# EAGLE schematic trig3_board_trigger_waveshare_lvds (EAGLE 9.6.2)
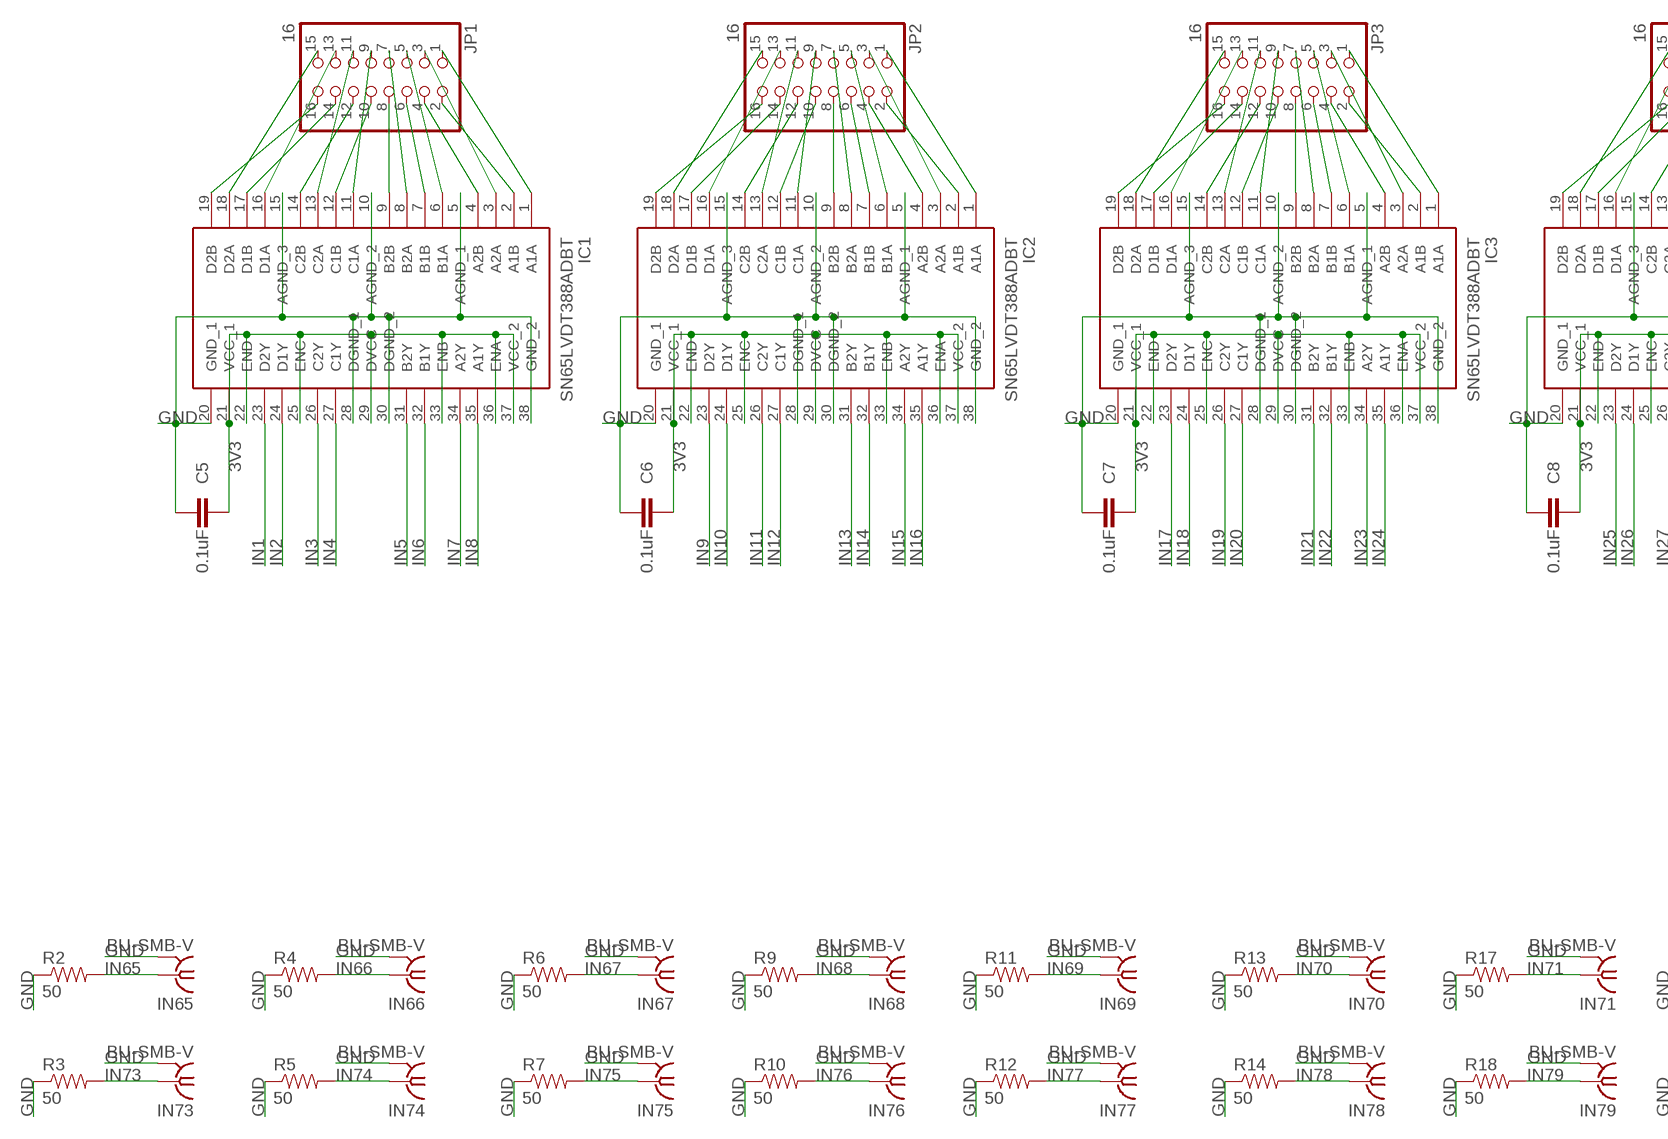
[diagram p0: schematic, sheet 1, part 1 of 3]
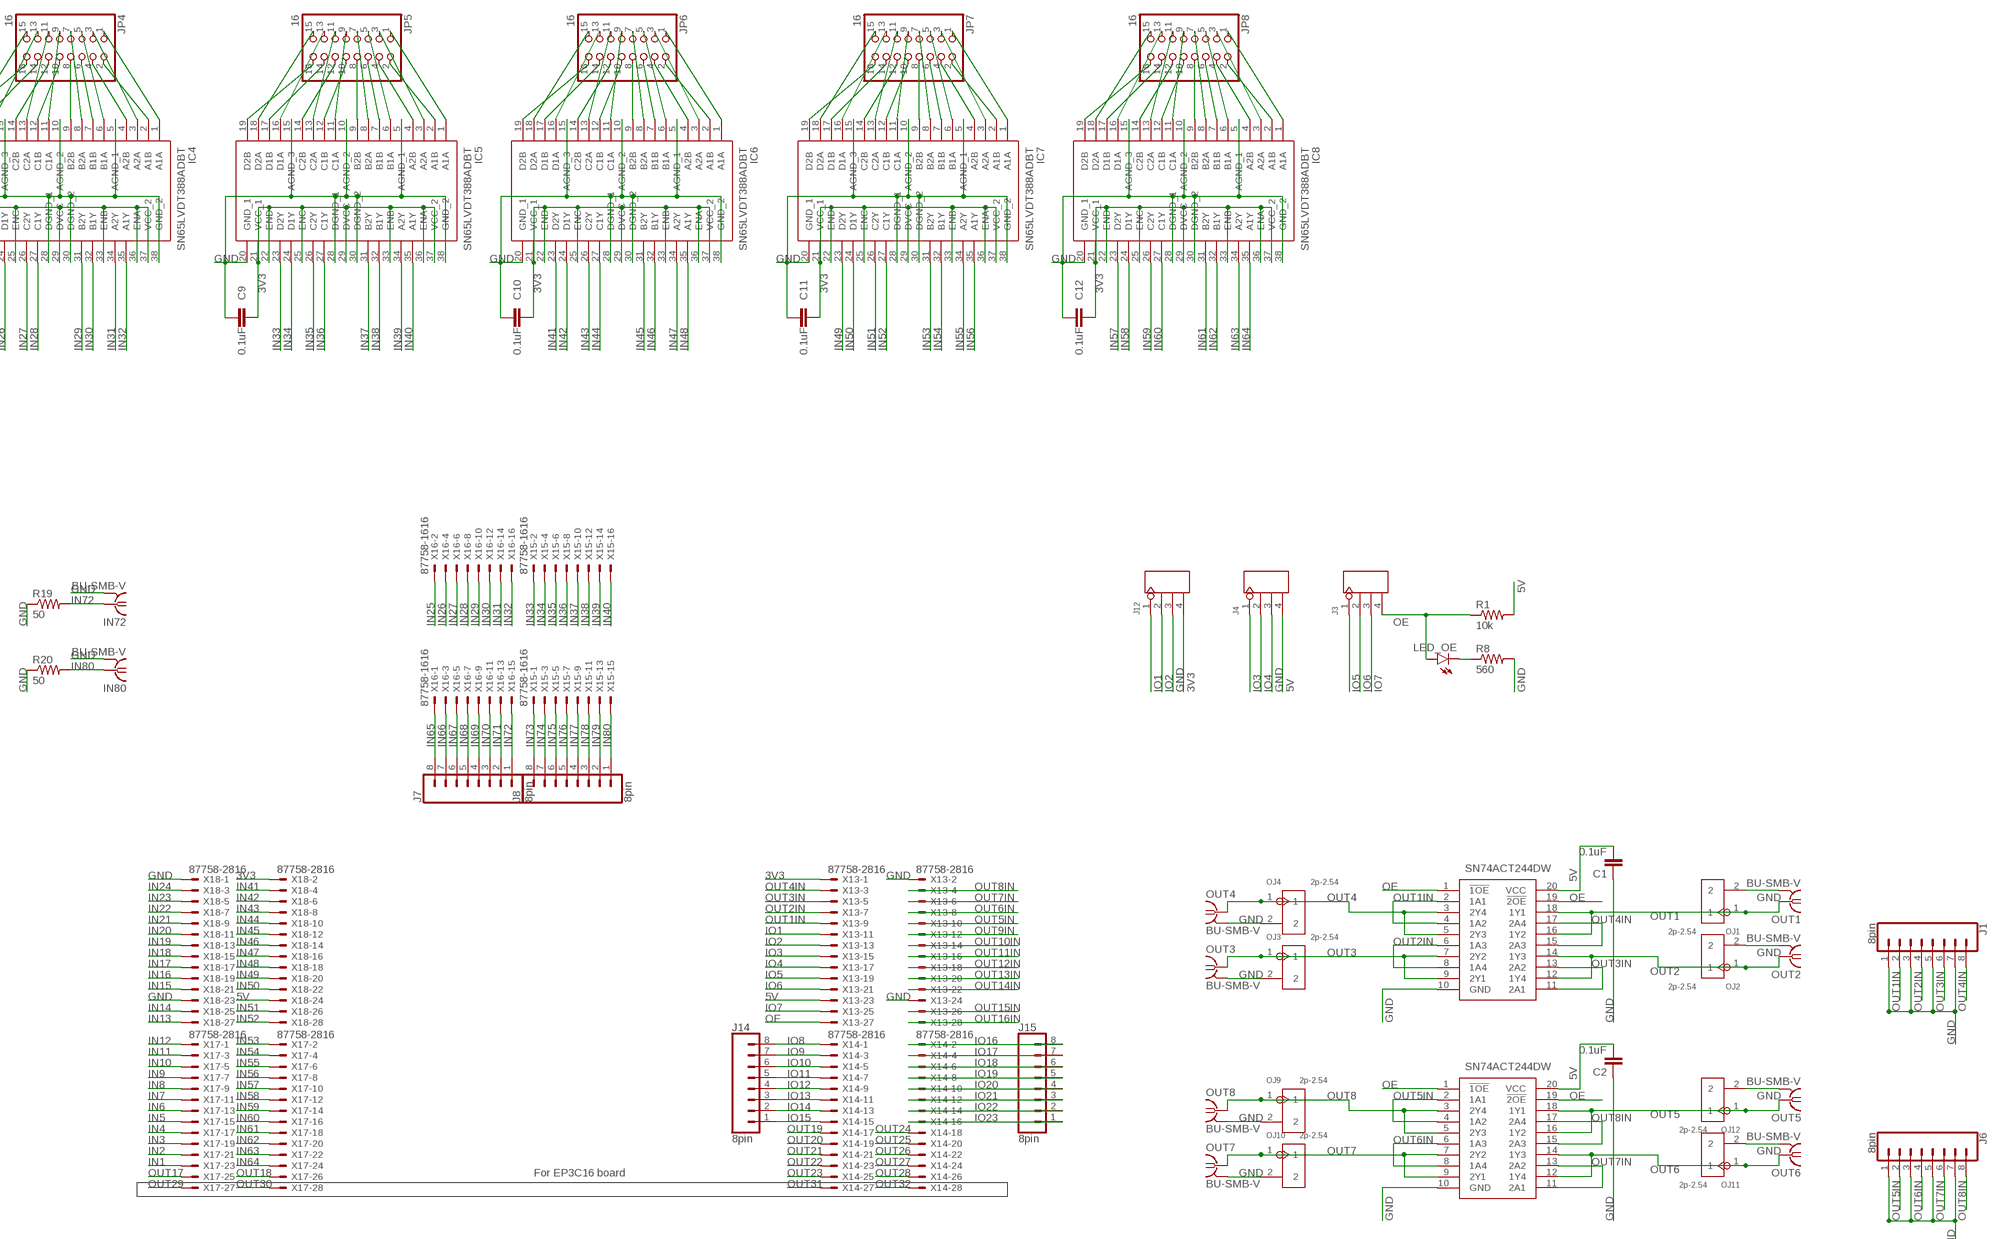
[diagram p1: schematic, sheet 1, part 2 of 3]
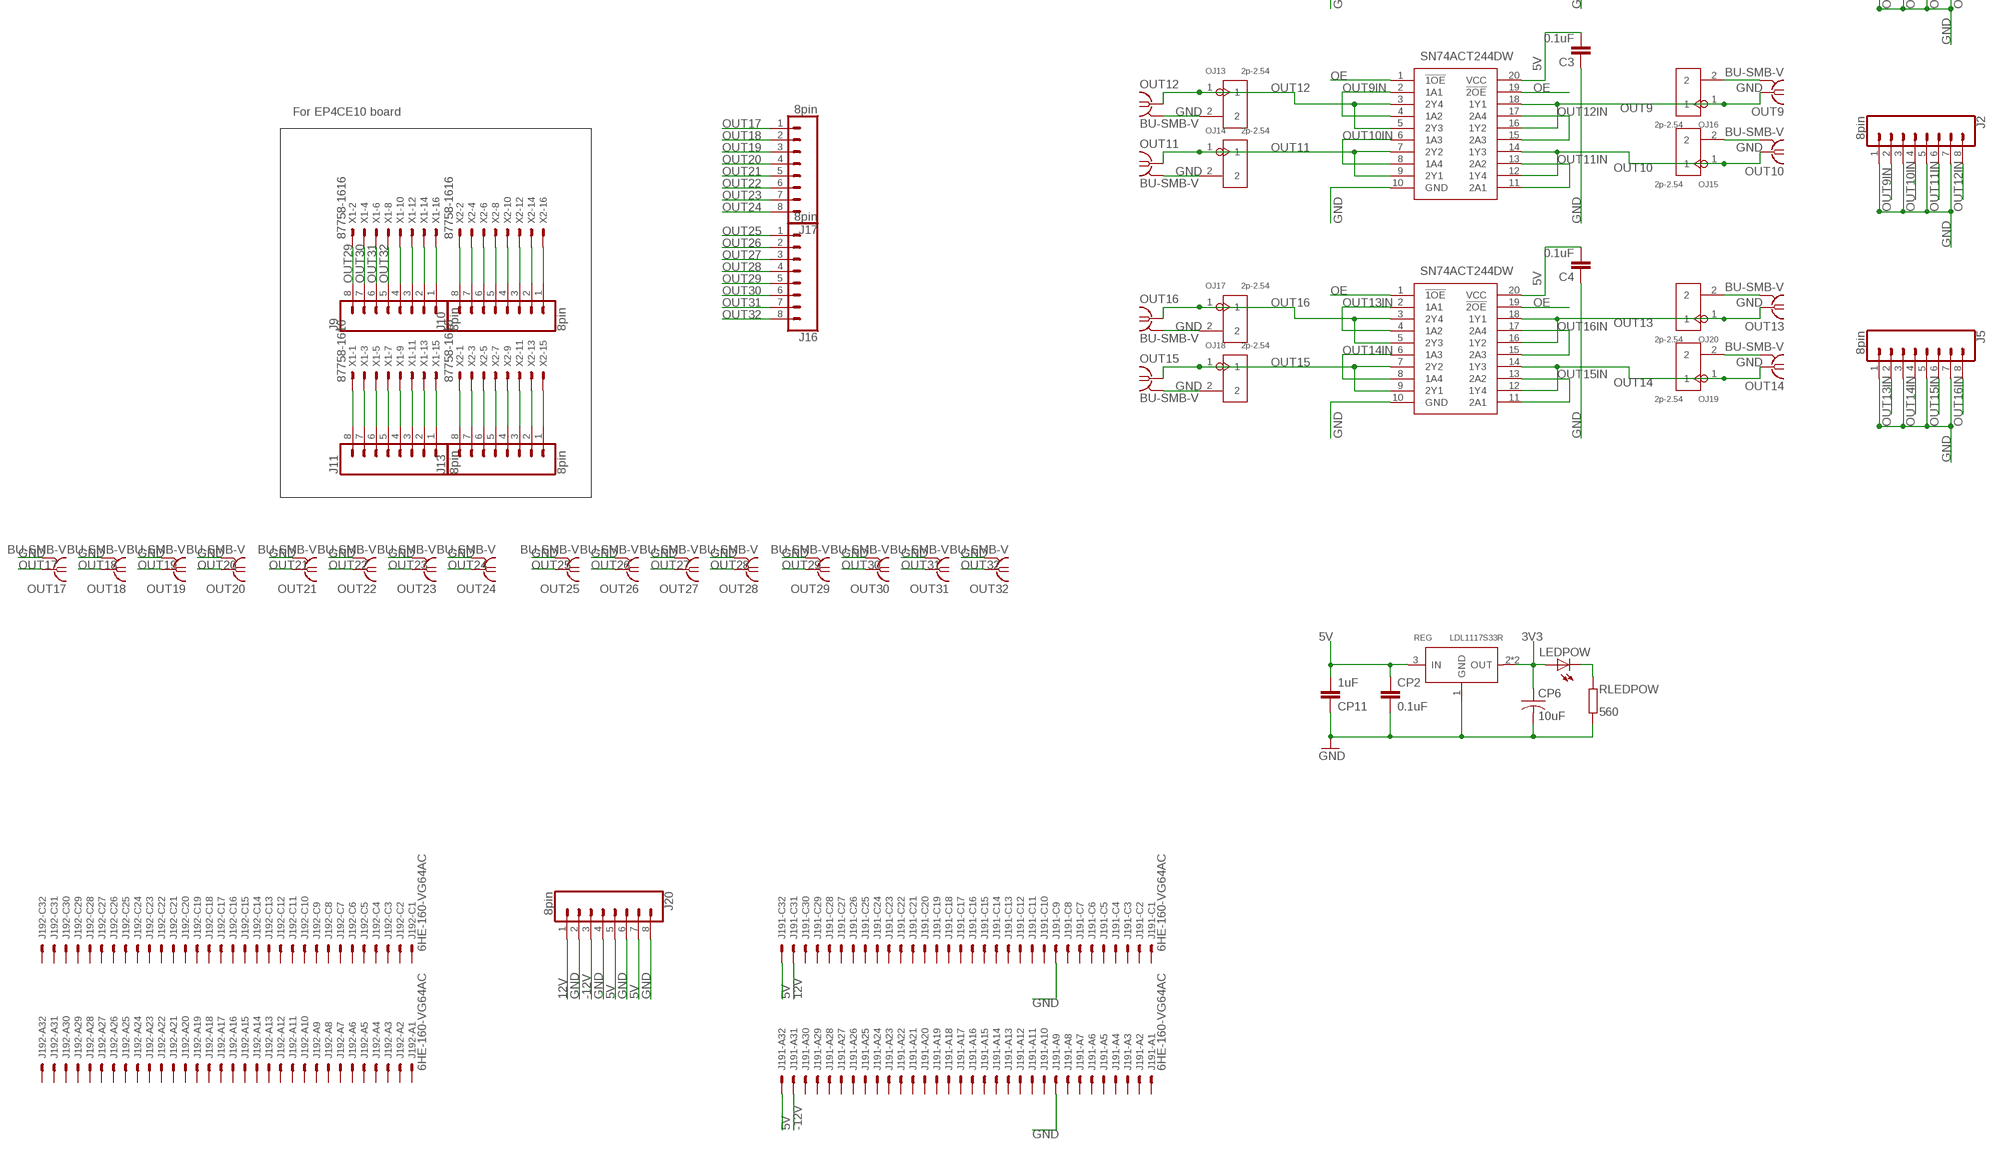
[diagram p2: schematic, sheet 1, part 3 of 3]

## Parts
C1  0.1uF  CAP0805  [0805]
C2  0.1uF  CAP0805  [0805]
C3  0.1uF  CAP0805  [0805]
C4  0.1uF  CAP0805  [0805]
C5  0.1uF  CAP0805  [0805]
C6  0.1uF  CAP0805  [0805]
C7  0.1uF  CAP0805  [0805]
C8  0.1uF  CAP0805  [0805]
C9  0.1uF  CAP0805  [0805]
C10  0.1uF  CAP0805  [0805]
C11  0.1uF  CAP0805  [0805]
C12  0.1uF  CAP0805  [0805]
CP2  0.1uF  C-EUC0805K  [C0805K]
CP6  10uF  C-USC1206  [C1206]
CP11  1uF  C-EUC0805K  [C0805K]
IC1  SN65LVDT388ADBT  [SOP50P640X120-38N]
IC2  SN65LVDT388ADBT  [SOP50P640X120-38N]
IC3  SN65LVDT388ADBT  [SOP50P640X120-38N]
IC4  SN65LVDT388ADBT  [SOP50P640X120-38N]
IC5  SN65LVDT388ADBT  [SOP50P640X120-38N]
IC6  SN65LVDT388ADBT  [SOP50P640X120-38N]
IC7  SN65LVDT388ADBT  [SOP50P640X120-38N]
IC8  SN65LVDT388ADBT  [SOP50P640X120-38N]
IN65  BU-SMB-V  [BU-SMB-V]
IN66  BU-SMB-V  [BU-SMB-V]
IN67  BU-SMB-V  [BU-SMB-V]
IN68  BU-SMB-V  [BU-SMB-V]
IN69  BU-SMB-V  [BU-SMB-V]
IN70  BU-SMB-V  [BU-SMB-V]
IN71  BU-SMB-V  [BU-SMB-V]
IN72  BU-SMB-V  [BU-SMB-V]
IN73  BU-SMB-V  [BU-SMB-V]
IN74  BU-SMB-V  [BU-SMB-V]
IN75  BU-SMB-V  [BU-SMB-V]
IN76  BU-SMB-V  [BU-SMB-V]
IN77  BU-SMB-V  [BU-SMB-V]
IN78  BU-SMB-V  [BU-SMB-V]
IN79  BU-SMB-V  [BU-SMB-V]
IN80  BU-SMB-V  [BU-SMB-V]
J1  8pin  CONN_08"  [1X08]
J2  8pin  CONN_08"  [1X08]
J3  4p-2.54  DIP-BLACK-FEMALE-HEADER-VERT(4P-2.54)  [H4-2.54]
J4  4p-2.54  DIP-BLACK-FEMALE-HEADER-VERT(4P-2.54)  [H4-2.54]
J5  8pin  CONN_08"  [1X08]
J6  8pin  CONN_08"  [1X08]
J7  8pin  CONN_08"  [1X08]
J8  8pin  CONN_08"  [1X08]
J9  8pin  CONN_08"  [1X08]
J10  8pin  CONN_08"  [1X08]
J11  8pin  CONN_08"  [1X08]
J12  4p-2.54  DIP-BLACK-FEMALE-HEADER-VERT(4P-2.54)  [H4-2.54]
J13  8pin  CONN_08"  [1X08]
J14  8pin  CONN_08"  [1X08]
J15  8pin  CONN_08"  [1X08]
J16  8pin  CONN_08"  [1X08]
J17  8pin  CONN_08"  [1X08]
J19  6HE-160-VG64AC  [6HE_160-VG64AC]
J20  8pin  CONN_08"  [1X08]
JP1  16  PINHD-2X8/90  [2X08/90]
JP2  16  PINHD-2X8/90  [2X08/90]
JP3  16  PINHD-2X8/90  [2X08/90]
JP4  16  PINHD-2X8/90  [2X08/90]
JP5  16  PINHD-2X8/90  [2X08/90]
JP6  16  PINHD-2X8/90  [2X08/90]
JP7  16  PINHD-2X8/90  [2X08/90]
JP8  16  PINHD-2X8/90  [2X08/90]
LED_OE  OutputEn  LEDCHIP-LED0805  [CHIP-LED0805]
LEDPOW  MF-LED-0805-RED  LEDSML0805  [SML0805]
OJ1  2p-2.54  DIP-BLACK-MALE-HEADER-VERT(2P-2.54)  [H2-2.54]
OJ2  2p-2.54  DIP-BLACK-MALE-HEADER-VERT(2P-2.54)  [H2-2.54]
OJ3  2p-2.54  DIP-BLACK-MALE-HEADER-VERT(2P-2.54)  [H2-2.54]
OJ4  2p-2.54  DIP-BLACK-MALE-HEADER-VERT(2P-2.54)  [H2-2.54]
OJ9  2p-2.54  DIP-BLACK-MALE-HEADER-VERT(2P-2.54)  [H2-2.54]
OJ10  2p-2.54  DIP-BLACK-MALE-HEADER-VERT(2P-2.54)  [H2-2.54]
OJ11  2p-2.54  DIP-BLACK-MALE-HEADER-VERT(2P-2.54)  [H2-2.54]
OJ12  2p-2.54  DIP-BLACK-MALE-HEADER-VERT(2P-2.54)  [H2-2.54]
OJ13  2p-2.54  DIP-BLACK-MALE-HEADER-VERT(2P-2.54)  [H2-2.54]
OJ14  2p-2.54  DIP-BLACK-MALE-HEADER-VERT(2P-2.54)  [H2-2.54]
OJ15  2p-2.54  DIP-BLACK-MALE-HEADER-VERT(2P-2.54)  [H2-2.54]
OJ16  2p-2.54  DIP-BLACK-MALE-HEADER-VERT(2P-2.54)  [H2-2.54]
OJ17  2p-2.54  DIP-BLACK-MALE-HEADER-VERT(2P-2.54)  [H2-2.54]
OJ18  2p-2.54  DIP-BLACK-MALE-HEADER-VERT(2P-2.54)  [H2-2.54]
OJ19  2p-2.54  DIP-BLACK-MALE-HEADER-VERT(2P-2.54)  [H2-2.54]
OJ20  2p-2.54  DIP-BLACK-MALE-HEADER-VERT(2P-2.54)  [H2-2.54]
OUT1  BU-SMB-V  [BU-SMB-V]
OUT2  BU-SMB-V  [BU-SMB-V]
OUT3  BU-SMB-V  [BU-SMB-V]
OUT4  BU-SMB-V  [BU-SMB-V]
OUT5  BU-SMB-V  [BU-SMB-V]
OUT6  BU-SMB-V  [BU-SMB-V]
OUT7  BU-SMB-V  [BU-SMB-V]
OUT8  BU-SMB-V  [BU-SMB-V]
OUT9  BU-SMB-V  [BU-SMB-V]
OUT10  BU-SMB-V  [BU-SMB-V]
OUT11  BU-SMB-V  [BU-SMB-V]
OUT12  BU-SMB-V  [BU-SMB-V]
OUT13  BU-SMB-V  [BU-SMB-V]
OUT14  BU-SMB-V  [BU-SMB-V]
OUT15  BU-SMB-V  [BU-SMB-V]
OUT16  BU-SMB-V  [BU-SMB-V]
OUT17  BU-SMB-V  [BU-SMB-V]
OUT18  BU-SMB-V  [BU-SMB-V]
OUT19  BU-SMB-V  [BU-SMB-V]
OUT20  BU-SMB-V  [BU-SMB-V]
OUT21  BU-SMB-V  [BU-SMB-V]
OUT22  BU-SMB-V  [BU-SMB-V]
OUT23  BU-SMB-V  [BU-SMB-V]
OUT24  BU-SMB-V  [BU-SMB-V]
OUT25  BU-SMB-V  [BU-SMB-V]
OUT26  BU-SMB-V  [BU-SMB-V]
OUT27  BU-SMB-V  [BU-SMB-V]
OUT28  BU-SMB-V  [BU-SMB-V]
OUT29  BU-SMB-V  [BU-SMB-V]
OUT30  BU-SMB-V  [BU-SMB-V]
OUT31  BU-SMB-V  [BU-SMB-V]
OUT32  BU-SMB-V  [BU-SMB-V]
R1  10k  R-US_R0805  [R0805]
R2  50  RESISTORAXIAL-0.3  [AXIAL-0.3]
R3  50  RESISTORAXIAL-0.3  [AXIAL-0.3]
R4  50  RESISTORAXIAL-0.3  [AXIAL-0.3]
R5  50  RESISTORAXIAL-0.3  [AXIAL-0.3]
R6  50  RESISTORAXIAL-0.3  [AXIAL-0.3]
R7  50  RESISTORAXIAL-0.3  [AXIAL-0.3]
R8  560  R-US_R0805  [R0805]
R9  50  RESISTORAXIAL-0.3  [AXIAL-0.3]
R10  50  RESISTORAXIAL-0.3  [AXIAL-0.3]
R11  50  RESISTORAXIAL-0.3  [AXIAL-0.3]
R12  50  RESISTORAXIAL-0.3  [AXIAL-0.3]
R13  50  RESISTORAXIAL-0.3  [AXIAL-0.3]
R14  50  RESISTORAXIAL-0.3  [AXIAL-0.3]
R17  50  RESISTORAXIAL-0.3  [AXIAL-0.3]
R18  50  RESISTORAXIAL-0.3  [AXIAL-0.3]
R19  50  RESISTORAXIAL-0.3  [AXIAL-0.3]
R20  50  RESISTORAXIAL-0.3  [AXIAL-0.3]
REG  LDL1117S33R  PMIC-CJT1117-3.3(SOT223)  [SOT-223]
RLEDPOW  560  R-EU_R0805  [R0805]
VSLUE  SN74ACT244DW  [SOIC127P1030X265-20N]
VSLUE2  SN74ACT244DW  [SOIC127P1030X265-20N]
VSLUE3  SN74ACT244DW  [SOIC127P1030X265-20N]
VSLUE4  SN74ACT244DW  [SOIC127P1030X265-20N]
X1  87758-1616  [87758-1616]
X2  87758-1616  [87758-1616]
X13  87758-2816  [87758-2816]
X14  87758-2816  [87758-2816]
X15  87758-1616  [87758-1616]
X16  87758-1616  [87758-1616]
X17  87758-2816  [87758-2816]
X18  87758-2816  [87758-2816]

## Nets
3V3 [power]: C5.2 C6.2 C7.2 C8.2 C9.2 C10.2 C11.2 C12.2 CP6.1 IC1.21(VCC_1) IC1.22(END) IC1.25(ENC) IC1.29(DVCC) IC1.33(ENB) IC1.36(ENA) IC1.37(VCC_2) IC2.21(VCC_1) IC2.22(END) IC2.25(ENC) IC2.29(DVCC) IC2.33(ENB) IC2.36(ENA) IC2.37(VCC_2) IC3.21(VCC_1) IC3.22(END) IC3.25(ENC) IC3.29(DVCC) IC3.33(ENB) IC3.36(ENA) IC3.37(VCC_2) IC4.21(VCC_1) IC4.22(END) IC4.25(ENC) IC4.29(DVCC) IC4.33(ENB) IC4.36(ENA) IC4.37(VCC_2) IC5.21(VCC_1) IC5.22(END) IC5.25(ENC) IC5.29(DVCC) IC5.33(ENB) IC5.36(ENA) IC5.37(VCC_2) IC6.21(VCC_1) IC6.22(END) IC6.25(ENC) IC6.29(DVCC) IC6.33(ENB) IC6.36(ENA) IC6.37(VCC_2) IC7.21(VCC_1) IC7.22(END) IC7.25(ENC) IC7.29(DVCC) IC7.33(ENB) IC7.36(ENA) IC7.37(VCC_2) IC8.21(VCC_1) IC8.22(END) IC8.25(ENC) IC8.29(DVCC) IC8.33(ENB) IC8.36(ENA) IC8.37(VCC_2) J12.4 LEDPOW.A REG.2(OUT) REG.TER(OUT) X13.1 X18.2
5V [power]: C1.2 C2.2 C3.2 C4.2 CP2.1 CP11.2 J4.4 J19.1-A32 J19.1-C32 J20.5 J20.7 R1.2 REG.3(IN) VSLUE2.20(VCC) VSLUE3.20(VCC) VSLUE4.20(VCC) VSLUE.20(VCC) X13.23 X18.24
12V [power]: J19.1-C31 J20.1
-12V [power]: J19.1-A31 J20.3
GND [power]: C1.1 C2.1 C3.1 C4.1 C5.1 C6.1 C7.1 C8.1 C9.1 C10.1 C11.1 C12.1 CP2.2 CP6.2 CP11.1 IC1.5(AGND_1) IC1.10(AGND_2) IC1.15(AGND_3) IC1.20(GND_1) IC1.28(DGND_1) IC1.30(DGND_2) IC1.38(GND_2) IC2.5(AGND_1) IC2.10(AGND_2) IC2.15(AGND_3) IC2.20(GND_1) IC2.28(DGND_1) IC2.30(DGND_2) IC2.38(GND_2) IC3.5(AGND_1) IC3.10(AGND_2) IC3.15(AGND_3) IC3.20(GND_1) IC3.28(DGND_1) IC3.30(DGND_2) IC3.38(GND_2) IC4.5(AGND_1) IC4.10(AGND_2) IC4.15(AGND_3) IC4.20(GND_1) IC4.28(DGND_1) IC4.30(DGND_2) IC4.38(GND_2) IC5.5(AGND_1) IC5.10(AGND_2) IC5.15(AGND_3) IC5.20(GND_1) IC5.28(DGND_1) IC5.30(DGND_2) IC5.38(GND_2) IC6.5(AGND_1) IC6.10(AGND_2) IC6.15(AGND_3) IC6.20(GND_1) IC6.28(DGND_1) IC6.30(DGND_2) IC6.38(GND_2) IC7.5(AGND_1) IC7.10(AGND_2) IC7.15(AGND_3) IC7.20(GND_1) IC7.28(DGND_1) IC7.30(DGND_2) IC7.38(GND_2) IC8.5(AGND_1) IC8.10(AGND_2) IC8.15(AGND_3) IC8.20(GND_1) IC8.28(DGND_1) IC8.30(DGND_2) IC8.38(GND_2) IN65.2 IN65.3 IN65.4 IN65.5 IN66.2 IN66.3 IN66.4 IN66.5 IN67.2 IN67.3 IN67.4 IN67.5 IN68.2 IN68.3 IN68.4 IN68.5 IN69.2 IN69.3 IN69.4 IN69.5 IN70.2 IN70.3 IN70.4 IN70.5 IN71.2 IN71.3 IN71.4 IN71.5 IN72.2 IN72.3 IN72.4 IN72.5 IN73.2 IN73.3 IN73.4 IN73.5 IN74.2 IN74.3 IN74.4 IN74.5 IN75.2 IN75.3 IN75.4 IN75.5 IN76.2 IN76.3 IN76.4 IN76.5 IN77.2 IN77.3 IN77.4 IN77.5 IN78.2 IN78.3 IN78.4 IN78.5 IN79.2 IN79.3 IN79.4 IN79.5 IN80.2 IN80.3 IN80.4 IN80.5 J1.1 J1.3 J1.5 J1.7 J2.1 J2.3 J2.5 J2.7 J4.3 J5.1 J5.3 J5.5 J5.7 J6.1 J6.3 J6.5 J6.7 J12.3 J19.1-A9 J19.1-C9 J20.2 J20.4 J20.6 J20.8 OJ1.2 OJ2.2 OJ3.2 OJ4.2 OJ9.2 OJ10.2 OJ11.2 OJ12.2 OJ13.2 OJ14.2 OJ15.2 OJ16.2 OJ17.2 OJ18.2 OJ19.2 OJ20.2 OUT1.2 OUT1.3 OUT1.4 OUT1.5 OUT2.2 OUT2.3 OUT2.4 OUT2.5 OUT3.2 OUT3.3 OUT3.4 OUT3.5 OUT4.2 OUT4.3 OUT4.4 OUT4.5 OUT5.2 OUT5.3 OUT5.4 OUT5.5 OUT6.2 OUT6.3 OUT6.4 OUT6.5 OUT7.2 OUT7.3 OUT7.4 OUT7.5 OUT8.2 OUT8.3 OUT8.4 OUT8.5 OUT9.2 OUT9.3 OUT9.4 OUT9.5 OUT10.2 OUT10.3 OUT10.4 OUT10.5 OUT11.2 OUT11.3 OUT11.4 OUT11.5 OUT12.2 OUT12.3 OUT12.4 OUT12.5 OUT13.2 OUT13.3 OUT13.4 OUT13.5 OUT14.2 OUT14.3 OUT14.4 OUT14.5 OUT15.2 OUT15.3 OUT15.4 OUT15.5 OUT16.2 OUT16.3 OUT16.4 OUT16.5 OUT17.2 OUT17.3 OUT17.4 OUT17.5 OUT18.2 OUT18.3 OUT18.4 OUT18.5 OUT19.2 OUT19.3 OUT19.4 OUT19.5 OUT20.2 OUT20.3 OUT20.4 OUT20.5 OUT21.2 OUT21.3 OUT21.4 OUT21.5 OUT22.2 OUT22.3 OUT22.4 OUT22.5 OUT23.2 OUT23.3 OUT23.4 OUT23.5 OUT24.2 OUT24.3 OUT24.4 OUT24.5 OUT25.2 OUT25.3 OUT25.4 OUT25.5 OUT26.2 OUT26.3 OUT26.4 OUT26.5 OUT27.2 OUT27.3 OUT27.4 OUT27.5 OUT28.2 OUT28.3 OUT28.4 OUT28.5 OUT29.2 OUT29.3 OUT29.4 OUT29.5 OUT30.2 OUT30.3 OUT30.4 OUT30.5 OUT31.2 OUT31.3 OUT31.4 OUT31.5 OUT32.2 OUT32.3 OUT32.4 OUT32.5 R2.P$1 R3.P$1 R4.P$1 R5.P$1 R6.P$1 R7.P$1 R8.2 R9.P$1 R10.P$1 R11.P$1 R12.P$1 R13.P$1 R14.P$1 R17.P$1 R18.P$1 R19.P$1 R20.P$1 REG.1(GND) RLEDPOW.2 VSLUE2.10(GND) VSLUE3.10(GND) VSLUE4.10(GND) VSLUE.10(GND) X13.2 X13.24 X18.1 X18.23
IN1: IC1.23(D2Y) X17.23
IN2: IC1.24(D1Y) X17.21
IN3: IC1.26(C2Y) X17.19
IN4: IC1.27(C1Y) X17.17
IN5: IC1.31(B2Y) X17.15
IN6: IC1.32(B1Y) X17.13
IN7: IC1.34(A2Y) X17.11
IN8: IC1.35(A1Y) X17.9
IN9: IC2.23(D2Y) X17.7
IN10: IC2.24(D1Y) X17.5
IN11: IC2.26(C2Y) X17.3
IN12: IC2.27(C1Y) X17.1
IN13: IC2.31(B2Y) X18.27
IN14: IC2.32(B1Y) X18.25
IN15: IC2.34(A2Y) X18.21
IN16: IC2.35(A1Y) X18.19
IN17: IC3.23(D2Y) X18.17
IN18: IC3.24(D1Y) X18.15
IN19: IC3.26(C2Y) X18.13
IN20: IC3.27(C1Y) X18.11
IN21: IC3.31(B2Y) X18.9
IN22: IC3.32(B1Y) X18.7
IN23: IC3.34(A2Y) X18.5
IN24: IC3.35(A1Y) X18.3
IN25: IC4.23(D2Y) X16.2
IN26: IC4.24(D1Y) X16.4
IN27: IC4.26(C2Y) X16.6
IN28: IC4.27(C1Y) X16.8
IN29: IC4.31(B2Y) X16.10
IN30: IC4.32(B1Y) X16.12
IN31: IC4.34(A2Y) X16.14
IN32: IC4.35(A1Y) X16.16
IN33: IC5.23(D2Y) X15.2
IN34: IC5.24(D1Y) X15.4
IN35: IC5.26(C2Y) X15.6
IN36: IC5.27(C1Y) X15.8
IN37: IC5.31(B2Y) X15.10
IN38: IC5.32(B1Y) X15.12
IN39: IC5.34(A2Y) X15.14
IN40: IC5.35(A1Y) X15.16
IN41: IC6.23(D2Y) X18.4
IN42: IC6.24(D1Y) X18.6
IN43: IC6.26(C2Y) X18.8
IN44: IC6.27(C1Y) X18.10
IN45: IC6.31(B2Y) X18.12
IN46: IC6.32(B1Y) X18.14
IN47: IC6.34(A2Y) X18.16
IN48: IC6.35(A1Y) X18.18
IN49: IC7.23(D2Y) X18.20
IN50: IC7.24(D1Y) X18.22
IN51: IC7.26(C2Y) X18.26
IN52: IC7.27(C1Y) X18.28
IN53: IC7.31(B2Y) X17.2
IN54: IC7.32(B1Y) X17.4
IN55: IC7.34(A2Y) X17.6
IN56: IC7.35(A1Y) X17.8
IN57: IC8.23(D2Y) X17.10
IN58: IC8.24(D1Y) X17.12
IN59: IC8.26(C2Y) X17.14
IN60: IC8.27(C1Y) X17.16
IN61: IC8.31(B2Y) X17.18
IN62: IC8.32(B1Y) X17.20
IN63: IC8.34(A2Y) X17.22
IN64: IC8.35(A1Y) X17.24
IN65: IN65.1 J7.8 R2.P$2 X16.1
IN66: IN66.1 J7.7 R4.P$2 X16.3
IN67: IN67.1 J7.6 R6.P$2 X16.5
IN68: IN68.1 J7.5 R9.P$2 X16.7
IN69: IN69.1 J7.4 R11.P$2 X16.9
IN70: IN70.1 J7.3 R13.P$2 X16.11
IN71: IN71.1 J7.2 R17.P$2 X16.13
IN72: IN72.1 J7.1 R19.P$2 X16.15
IN73: IN73.1 J8.8 R3.P$2 X15.1
IN74: IN74.1 J8.7 R5.P$2 X15.3
IN75: IN75.1 J8.6 R7.P$2 X15.5
IN76: IN76.1 J8.5 R10.P$2 X15.7
IN77: IN77.1 J8.4 R12.P$2 X15.9
IN78: IN78.1 J8.3 R14.P$2 X15.11
IN79: IN79.1 J8.2 R18.P$2 X15.13
IN80: IN80.1 J8.1 R20.P$2 X15.15
IO1: J12.1 X13.11
IO2: J12.2 X13.13
IO3: J4.1 X13.15
IO4: J4.2 X13.17
IO5: J3.1 X13.19
IO6: J3.2 X13.21
IO7: J3.3 X13.25
IO8: J14.8 X14.1
IO9: J14.7 X14.3
IO10: J14.6 X14.5
IO11: J14.5 X14.7
IO12: J14.4 X14.9
IO13: J14.3 X14.11
IO14: J14.2 X14.13
IO15: J14.1 X14.15
IO16: J15.8 X14.2
IO17: J15.7 X14.4
IO18: J15.6 X14.6
IO19: J15.5 X14.8
IO20: J15.4 X14.10
IO21: J15.3 X14.12
IO22: J15.2 X14.14
IO23: J15.1 X14.16
N$1: IC2.1(A1A) JP2.1
N$2: IC2.2(A1B) JP2.2
N$3: IC2.3(A2A) JP2.3
N$4: IC2.4(A2B) JP2.4
N$5: IC2.6(B1A) JP2.5
N$6: IC2.7(B1B) JP2.6
N$7: IC2.8(B2A) JP2.7
N$8: IC2.9(B2B) JP2.8
N$9: IC1.1(A1A) JP1.1
N$10: IC1.2(A1B) JP1.2
N$11: IC1.3(A2A) JP1.3
N$12: IC1.4(A2B) JP1.4
N$13: IC1.6(B1A) JP1.5
N$14: IC1.7(B1B) JP1.6
N$15: IC1.8(B2A) JP1.7
N$16: IC1.9(B2B) JP1.8
N$17: IC1.11(C1A) JP1.9
N$18: IC1.12(C1B) JP1.10
N$19: IC1.13(C2A) JP1.11
N$20: IC1.14(C2B) JP1.12
N$21: IC1.16(D1A) JP1.13
N$22: IC1.17(D1B) JP1.14
N$23: IC1.18(D2A) JP1.15
N$24: IC1.19(D2B) JP1.16
N$25: IC2.11(C1A) JP2.9
N$26: IC2.12(C1B) JP2.10
N$27: IC2.13(C2A) JP2.11
N$28: IC2.14(C2B) JP2.12
N$29: IC2.16(D1A) JP2.13
N$30: IC2.17(D1B) JP2.14
N$31: IC2.18(D2A) JP2.15
N$32: IC2.19(D2B) JP2.16
N$33: IC3.1(A1A) JP3.1
N$34: IC3.2(A1B) JP3.2
N$35: IC3.3(A2A) JP3.3
N$36: LEDPOW.C RLEDPOW.1
N$37: IC3.4(A2B) JP3.4
N$38: IC3.6(B1A) JP3.5
N$39: IC3.7(B1B) JP3.6
N$40: IC3.8(B2A) JP3.7
N$41: IC3.9(B2B) JP3.8
N$42: IC3.11(C1A) JP3.9
N$43: IC3.12(C1B) JP3.10
N$44: IC3.13(C2A) JP3.11
N$45: IC3.14(C2B) JP3.12
N$46: IC3.16(D1A) JP3.13
N$47: IC3.17(D1B) JP3.14
N$48: IC3.18(D2A) JP3.15
N$49: IC3.19(D2B) JP3.16
N$50: IC4.1(A1A) JP4.1
N$51: IC4.2(A1B) JP4.2
N$52: IC4.3(A2A) JP4.3
N$53: IC4.4(A2B) JP4.4
N$54: IC4.6(B1A) JP4.5
N$55: IC4.7(B1B) JP4.6
N$56: IC4.8(B2A) JP4.7
N$57: IC4.9(B2B) JP4.8
N$58: IC4.11(C1A) JP4.9
N$59: IC4.12(C1B) JP4.10
N$60: IC4.13(C2A) JP4.11
N$61: IC4.14(C2B) JP4.12
N$62: IC4.16(D1A) JP4.13
N$63: IC4.17(D1B) JP4.14
N$64: IC4.18(D2A) JP4.15
N$65: IC4.19(D2B) JP4.16
N$66: IC5.1(A1A) JP5.1
N$67: IC5.2(A1B) JP5.2
N$68: IC5.3(A2A) JP5.3
N$69: IC5.4(A2B) JP5.4
N$70: IC5.6(B1A) JP5.5
N$71: IC5.7(B1B) JP5.6
N$72: IC5.8(B2A) JP5.7
N$73: IC5.9(B2B) JP5.8
N$74: IC5.11(C1A) JP5.9
N$75: IC5.12(C1B) JP5.10
N$76: IC5.13(C2A) JP5.11
N$77: IC5.14(C2B) JP5.12
N$78: IC5.16(D1A) JP5.13
N$79: IC5.17(D1B) JP5.14
N$80: IC5.18(D2A) JP5.15
N$81: IC5.19(D2B) JP5.16
N$82: IC6.1(A1A) JP6.1
N$83: IC6.2(A1B) JP6.2
N$84: IC6.3(A2A) JP6.3
N$85: IC6.4(A2B) JP6.4
N$86: IC6.6(B1A) JP6.5
N$87: IC6.7(B1B) JP6.6
N$88: IC6.8(B2A) JP6.7
N$89: IC6.9(B2B) JP6.8
N$90: IC6.11(C1A) JP6.9
N$91: IC6.12(C1B) JP6.10
N$92: IC6.13(C2A) JP6.11
N$93: IC6.14(C2B) JP6.12
N$94: IC6.16(D1A) JP6.13
N$95: IC6.17(D1B) JP6.14
N$96: IC6.18(D2A) JP6.15
N$97: IC6.19(D2B) JP6.16
N$98: IC7.1(A1A) JP7.1
N$99: IC7.2(A1B) JP7.2
N$100: IC7.3(A2A) JP7.3
N$101: IC7.4(A2B) JP7.4
N$102: IC7.6(B1A) JP7.5
N$103: IC7.7(B1B) JP7.6
N$104: IC7.8(B2A) JP7.7
N$105: IC7.9(B2B) JP7.8
N$106: IC7.11(C1A) JP7.9
N$107: IC7.12(C1B) JP7.10
N$108: IC7.13(C2A) JP7.11
N$109: IC7.14(C2B) JP7.12
N$110: IC7.16(D1A) JP7.13
N$111: IC7.17(D1B) JP7.14
N$112: IC7.18(D2A) JP7.15
N$113: IC7.19(D2B) JP7.16
N$114: IC8.1(A1A) JP8.1
N$115: IC8.2(A1B) JP8.2
N$116: IC8.3(A2A) JP8.3
N$117: IC8.4(A2B) JP8.4
N$118: IC8.6(B1A) JP8.5
N$119: IC8.7(B1B) JP8.6
N$120: IC8.8(B2A) JP8.7
N$121: IC8.9(B2B) JP8.8
N$122: IC8.11(C1A) JP8.9
N$123: IC8.12(C1B) JP8.10
N$124: IC8.13(C2A) JP8.11
N$125: IC8.14(C2B) JP8.12
N$126: IC8.16(D1A) JP8.13
N$127: IC8.17(D1B) JP8.14
N$128: IC8.18(D2A) JP8.15
N$129: IC8.19(D2B) JP8.16
N$131: LED_OE.C R8.1
N$253: J9.4 X1.10
N$254: J9.3 X1.12
N$255: J9.2 X1.14
N$256: J9.1 X1.16
N$257: J10.8 X2.2
N$258: J10.7 X2.4
N$259: J10.6 X2.6
N$260: J10.5 X2.8
N$261: J10.4 X2.10
N$262: J10.3 X2.12
N$263: J10.2 X2.14
N$264: J10.1 X2.16
N$265: J11.8 X1.1
N$266: J11.7 X1.3
N$267: J11.6 X1.5
N$268: J11.5 X1.7
N$269: J11.4 X1.9
N$270: J11.3 X1.11
N$271: J11.2 X1.13
N$272: J11.1 X1.15
N$273: J13.8 X2.1
N$274: J13.7 X2.3
N$275: J13.6 X2.5
N$276: J13.5 X2.7
N$277: J13.4 X2.9
N$278: J13.3 X2.11
N$279: J13.2 X2.13
N$280: J13.1 X2.15
OE: J3.4 LED_OE.A R1.1 VSLUE2.1(!1OE) VSLUE2.19(!2OE) VSLUE3.1(!1OE) VSLUE3.19(!2OE) VSLUE4.1(!1OE) VSLUE4.19(!2OE) VSLUE.1(!1OE) VSLUE.19(!2OE) X13.27
OUT1: OJ1.1 OUT1.1 VSLUE.16(1Y2) VSLUE.18(1Y1)
OUT1IN: J1.2 VSLUE.2(1A1) VSLUE.4(1A2) X13.9
OUT2: OJ2.1 OUT2.1 VSLUE.12(1Y4) VSLUE.14(1Y3)
OUT2IN: J1.4 VSLUE.6(1A3) VSLUE.8(1A4) X13.7
OUT3: OJ3.1 OUT3.1 VSLUE.7(2Y2) VSLUE.9(2Y1)
OUT3IN: J1.6 VSLUE.11(2A1) VSLUE.13(2A2) X13.5
OUT4: OJ4.1 OUT4.1 VSLUE.3(2Y4) VSLUE.5(2Y3)
OUT4IN: J1.8 VSLUE.15(2A3) VSLUE.17(2A4) X13.3
OUT5: OJ12.1 OUT5.1 VSLUE2.16(1Y2) VSLUE2.18(1Y1)
OUT5IN: J6.2 VSLUE2.2(1A1) VSLUE2.4(1A2) X13.10
OUT6: OJ11.1 OUT6.1 VSLUE2.12(1Y4) VSLUE2.14(1Y3)
OUT6IN: J6.4 VSLUE2.6(1A3) VSLUE2.8(1A4) X13.8
OUT7: OJ10.1 OUT7.1 VSLUE2.7(2Y2) VSLUE2.9(2Y1)
OUT7IN: J6.6 VSLUE2.11(2A1) VSLUE2.13(2A2) X13.6
OUT8: OJ9.1 OUT8.1 VSLUE2.3(2Y4) VSLUE2.5(2Y3)
OUT8IN: J6.8 VSLUE2.15(2A3) VSLUE2.17(2A4) X13.4
OUT9: OJ16.1 OUT9.1 VSLUE3.16(1Y2) VSLUE3.18(1Y1)
OUT9IN: J2.2 VSLUE3.2(1A1) VSLUE3.4(1A2) X13.12
OUT10: OJ15.1 OUT10.1 VSLUE3.12(1Y4) VSLUE3.14(1Y3)
OUT10IN: J2.4 VSLUE3.6(1A3) VSLUE3.8(1A4) X13.14
OUT11: OJ14.1 OUT11.1 VSLUE3.7(2Y2) VSLUE3.9(2Y1)
OUT11IN: J2.6 VSLUE3.11(2A1) VSLUE3.13(2A2) X13.16
OUT12: OJ13.1 OUT12.1 VSLUE3.3(2Y4) VSLUE3.5(2Y3)
OUT12IN: J2.8 VSLUE3.15(2A3) VSLUE3.17(2A4) X13.18
OUT13: OJ20.1 OUT13.1 VSLUE4.16(1Y2) VSLUE4.18(1Y1)
OUT13IN: J5.2 VSLUE4.2(1A1) VSLUE4.4(1A2) X13.20
OUT14: OJ19.1 OUT14.1 VSLUE4.12(1Y4) VSLUE4.14(1Y3)
OUT14IN: J5.4 VSLUE4.6(1A3) VSLUE4.8(1A4) X13.22
OUT15: OJ18.1 OUT15.1 VSLUE4.7(2Y2) VSLUE4.9(2Y1)
OUT15IN: J5.6 VSLUE4.11(2A1) VSLUE4.13(2A2) X13.26
OUT16: OJ17.1 OUT16.1 VSLUE4.3(2Y4) VSLUE4.5(2Y3)
OUT16IN: J5.8 VSLUE4.15(2A3) VSLUE4.17(2A4) X13.28
OUT17: J17.1 OUT17.1 X17.25
OUT18: J17.2 OUT18.1 X17.26
OUT19: J17.3 OUT19.1 X14.17
OUT20: J17.4 OUT20.1 X14.19
OUT21: J17.5 OUT21.1 X14.21
OUT22: J17.6 OUT22.1 X14.23
OUT23: J17.7 OUT23.1 X14.25
OUT24: J17.8 OUT24.1 X14.18
OUT25: J16.1 OUT25.1 X14.20
OUT26: J16.2 OUT26.1 X14.22
OUT27: J16.3 OUT27.1 X14.24
OUT28: J16.4 OUT28.1 X14.26
OUT29: J9.8 J16.5 OUT29.1 X1.2 X17.27
OUT30: J9.7 J16.6 OUT30.1 X1.4 X17.28
OUT31: J9.6 J16.7 OUT31.1 X1.6 X14.27
OUT32: J9.5 J16.8 OUT32.1 X1.8 X14.28
Unconnected: J19.1-A1 J19.1-A2 J19.1-A3 J19.1-A4 J19.1-A5 J19.1-A6 J19.1-A7 J19.1-A8 J19.1-A10 J19.1-A11 J19.1-A12 J19.1-A13 J19.1-A14 J19.1-A15 J19.1-A16 J19.1-A17 J19.1-A18 J19.1-A19 J19.1-A20 J19.1-A21 J19.1-A22 J19.1-A23 J19.1-A24 J19.1-A25 J19.1-A26 J19.1-A27 J19.1-A28 J19.1-A29 J19.1-A30 J19.1-C1 J19.1-C2 J19.1-C3 J19.1-C4 J19.1-C5 J19.1-C6 J19.1-C7 J19.1-C8 J19.1-C10 J19.1-C11 J19.1-C12 J19.1-C13 J19.1-C14 J19.1-C15 J19.1-C16 J19.1-C17 J19.1-C18 J19.1-C19 J19.1-C20 J19.1-C21 J19.1-C22 J19.1-C23 J19.1-C24 J19.1-C25 J19.1-C26 J19.1-C27 J19.1-C28 J19.1-C29 J19.1-C30 J19.2-A1 J19.2-A2 J19.2-A3 J19.2-A4 J19.2-A5 J19.2-A6 J19.2-A7 J19.2-A8 J19.2-A9 J19.2-A10 J19.2-A11 J19.2-A12 J19.2-A13 J19.2-A14 J19.2-A15 J19.2-A16 J19.2-A17 J19.2-A18 J19.2-A19 J19.2-A20 J19.2-A21 J19.2-A22 J19.2-A23 J19.2-A24 J19.2-A25 J19.2-A26 J19.2-A27 J19.2-A28 J19.2-A29 J19.2-A30 J19.2-A31 J19.2-A32 J19.2-C1 J19.2-C2 J19.2-C3 J19.2-C4 J19.2-C5 J19.2-C6 J19.2-C7 J19.2-C8 J19.2-C9 J19.2-C10 J19.2-C11 J19.2-C12 J19.2-C13 J19.2-C14 J19.2-C15 J19.2-C16 J19.2-C17 J19.2-C18 J19.2-C19 J19.2-C20 J19.2-C21 J19.2-C22 J19.2-C23 J19.2-C24 J19.2-C25 J19.2-C26 J19.2-C27 J19.2-C28 J19.2-C29 J19.2-C30 J19.2-C31 J19.2-C32

## Notes on the sheet
- For EP3C16 board
- For EP4CE10 board

## Library data of the parts
C1-C12 = SparkFun-Capacitors:CAP: Capacitor Standard 0603 ceramic capacitor, and 0.1" leaded capacitor.
CP2 = rcl:C-EU: CAPACITOR, European symbol; MPN: MF-CAP-0805-0.1uF
CP6 = rcl@1:C-US: CAPACITOR, American symbol; MPN: MF-CAP-1206-10uF
CP11 = rcl:C-EU: CAPACITOR, European symbol; MPN: MF-CAP-0805-1uF
IC1-IC8 = SamacSys_Parts:SN65LVDT388ADBT: Texas Instruments SN65LVDT388ADBT, LVDS Receiver, 3 3.6 V, 38-Pin, TSSOP Source: Datasheet <http://www.ti.com/lit/gpn/sn65lvdt388a>; DESCRIPTION: Texas Instruments SN65LVDT388ADBT, LVDS Receiver, 3 3.6 V, 38-Pin, TSSOP; HEIGHT: 1.2mm; MANUFACTURER_NAME: Texas Instruments; MANUFACTURER_PART_NUMBER: SN65LVDT388ADBT; MOUSER_PART_NUMBER: 595-SN65LVDT388ADBT; MOUSER_PRICE-STOCK: https://www.mouser.co.uk/ProductDetail/Texas-Instruments/SN65LVDT388ADBT?qs=QViXGNcIEAthmCAzU7rtXw%3D%3D
IN65-IN80 OUT1-OUT32 = con-coax:BU-SMB-V: FEMALE SMB CONNECTOR Radiall distributor RS 112-2993; OC_FARNELL: unknown; OC_NEWARK: unknown
J1 J2 J5-J11 J13-J17 J20 = SparkFun-Connectors:CONN_08: Multi connection point. Often used as Generic Header-pin footprint for 0.1 inch spaced/style header connections On any of the 0.1 inch spaced packages, you can populate with these: Break Away Headers - Straight <https://www.sparkfun.com/products/116> (PRT-00116) Break Away Male Headers - Right Angle <https://www.sparkfun.com/products/553> (PRT-00553) Female Headers <https://www.sparkfun.com/products/115> (PRT-00115) Break Away Headers - Machine Pin <https://www.sparkfun.com/products/117> (PRT-00117) Break Away Female Headers - Swiss Machine Pin <https://www.sparkfun.com/products/743> (PRT-00743) Arduino Stackable Header - 8 Pin <https://www.sparkfun.com/products/9279> (PRT-09279) For SCREWTERMINALS and SPRING TERMINALS visit here: Screw Terimnals on SparkFun.com <https://www.sparkfun.com/search/results?term=Screw+Terminals> (5mm/3.5mm/2.54mm spacing) This device is also useful as a general connection point to wire up your design to another part of your project. Our various solder wires solder well into these plated through hole pads. Hook-Up Wire - Assortment (Stranded, 22 AWG) <https://www.sparkfun.com/products/11375> (PRT-11375) Hook-Up Wire - Assortment (Solid Core, 22 AWG) <https://www.sparkfun.com/products/11367> (PRT-11367) View the entire wire category on our website here <https://www.sparkfun.com/categories/141> Special notes: Molex polarized connector foot print use with SKU : PRT-08231 with associated crimp pins and housings. 1MM SMD Version SKU: PRT-10208 NOTES ON THE VARIANTS LOCK and LOCK_LONGPADS... This footprint was designed to help hold the alignment of a through-hole component (i.e. 6-pin header) while soldering it into place. You may notice that each hole has been shifted either up or down by 0.005 of an inch from it's more standard position (which is a perfectly straight line). This slight alteration caused the pins (the squares in the middle) to touch the edges of the holes. Because they are alternating, it causes a "brace" to hold the component in place. 0.005 has proven to be the perfect amount of "off-center" position when using our standard breakaway headers. Although looks a little odd when you look at the bare footprint, once you have a header in there, the alteration is very hard to notice. Also,if you push a header all the way into place, it is covered up entirely on the bottom side.; PROD_ID: CONN-08438
J3 J4 J12 = Seeed-Connector:DIP-BLACK-FEMALE-HEADER-VERT(4P-2.54): 320030017; MPN: F185-1104A1BSYA1
J19 = 19inch:6HE-?-VG64AC: Euro Card with 2 x VG-64 AC connector
JP1-JP8 = pinhead:PINHD-2X8: PIN HEADER
LED_OE = led:LED: LED OSRAM: - CHIPLED LG R971, LG N971, LY N971, LG Q971, LY Q971, LO R971, LY R971 LH N974, LH R974 LS Q976, LO Q976, LY Q976 LO Q996 - Hyper CHIPLED LW Q18S LB Q993, LB Q99A, LB R99A - SideLED LS A670, LO A670, LY A670, LG A670, LP A670 LB A673, LV A673, LT A673, LW A673 LH A674 LY A675 LS A676, LA A676, LO A676, LY A676, LW A676 LS A679, LY A679, LG A679 - Hyper Micro SIDELED® LS Y876, LA Y876, LO Y876, LY Y876 LT Y87S - SmartLED LW L88C, LW L88S LB L89C, LB L89S, LG L890 LS L89K, LO L89K, LY L89K LS L896, LA L896, LO L896, LY L896 - TOPLED LS T670, LO T670, LY T670, LG T670, LP T670 LSG T670, LSP T670, LSY T670, LOP T670, LYG T670 LG T671, LOG T671, LSG T671 LB T673, LV T673, LT T673, LW T673 LH T674 LS T676, LA T676, LO T676, LY T676, LB T676, LH T676, LSB T676, LW T676 LB T67C, LV T67C, LT T67C, LS T67K, LO T67K, LY T67K, LW E67C LS E67B, LA E67B, LO E67B, LY E67B, LB E67C, LV E67C, LT E67C LW T67C LS T679, LY T679, LG T679 LS T770, LO T770, LY T770, LG T770, LP T770 LB T773, LV T773, LT T773, LW T773 LH T774 LS E675, LA E675, LY E675, LS T675 LS T776, LA T776, LO T776, LY T776, LB T776 LHGB T686 LT T68C, LB T68C - Hyper Mini TOPLED® LB M676 - Mini TOPLED Santana® LG M470 LS M47K, LO M47K, LY M47K Source: http://www.osram.convergy.de LUXEON: - LUMILED® LXK2-PW12-R00, LXK2-PW12-S00, LXK2-PW14-U00, LXK2-PW14-V00 LXK2-PM12-R00, LXK2-PM12-S00, LXK2-PM14-U00 LXK2-PE12-Q00, LXK2-PE12-R00, LXK2-PE12-S00, LXK2-PE14-T00, LXK2-PE14-U00 LXK2-PB12-K00, LXK2-PB12-L00, LXK2-PB12-M00, LXK2-PB14-N00, LXK2-PB14-P00, LXK2-PB14-Q00 LXK2-PR12-L00, LXK2-PR12-M00, LXK2-PR14-Q00, LXK2-PR14-R00 LXK2-PD12-Q00, LXK2-PD12-R00, LXK2-PD12-S00 LXK2-PH12-R00, LXK2-PH12-S00 LXK2-PL12-P00, LXK2-PL12-Q00, LXK2-PL12-R00 Source: www.luxeon.com KINGBRIGHT: KA-3528ASYC Source: www.kingbright.com
LEDPOW = led:LED: LED OSRAM: - CHIPLED LG R971, LG N971, LY N971, LG Q971, LY Q971, LO R971, LY R971 LH N974, LH R974 LS Q976, LO Q976, LY Q976 LO Q996 - Hyper CHIPLED LW Q18S LB Q993, LB Q99A, LB R99A - SideLED LS A670, LO A670, LY A670, LG A670, LP A670 LB A673, LV A673, LT A673, LW A673 LH A674 LY A675 LS A676, LA A676, LO A676, LY A676, LW A676 LS A679, LY A679, LG A679 - Hyper Micro SIDELED® LS Y876, LA Y876, LO Y876, LY Y876 LT Y87S - SmartLED LW L88C, LW L88S LB L89C, LB L89S, LG L890 LS L89K, LO L89K, LY L89K LS L896, LA L896, LO L896, LY L896 - TOPLED LS T670, LO T670, LY T670, LG T670, LP T670 LSG T670, LSP T670, LSY T670, LOP T670, LYG T670 LG T671, LOG T671, LSG T671 LB T673, LV T673, LT T673, LW T673 LH T674 LS T676, LA T676, LO T676, LY T676, LB T676, LH T676, LSB T676, LW T676 LB T67C, LV T67C, LT T67C, LS T67K, LO T67K, LY T67K, LW E67C LS E67B, LA E67B, LO E67B, LY E67B, LB E67C, LV E67C, LT E67C LW T67C LS T679, LY T679, LG T679 LS T770, LO T770, LY T770, LG T770, LP T770 LB T773, LV T773, LT T773, LW T773 LH T774 LS E675, LA E675, LY E675, LS T675 LS T776, LA T776, LO T776, LY T776, LB T776 LHGB T686 LT T68C, LB T68C - Hyper Mini TOPLED® LB M676 - Mini TOPLED Santana® LG M470 LS M47K, LO M47K, LY M47K Source: http://www.osram.convergy.de LUXEON: - LUMILED® LXK2-PW12-R00, LXK2-PW12-S00, LXK2-PW14-U00, LXK2-PW14-V00 LXK2-PM12-R00, LXK2-PM12-S00, LXK2-PM14-U00 LXK2-PE12-Q00, LXK2-PE12-R00, LXK2-PE12-S00, LXK2-PE14-T00, LXK2-PE14-U00 LXK2-PB12-K00, LXK2-PB12-L00, LXK2-PB12-M00, LXK2-PB14-N00, LXK2-PB14-P00, LXK2-PB14-Q00 LXK2-PR12-L00, LXK2-PR12-M00, LXK2-PR14-Q00, LXK2-PR14-R00 LXK2-PD12-Q00, LXK2-PD12-R00, LXK2-PD12-S00 LXK2-PH12-R00, LXK2-PH12-S00 LXK2-PL12-P00, LXK2-PL12-Q00, LXK2-PL12-R00 Source: www.luxeon.com KINGBRIGHT: KA-3528ASYC Source: www.kingbright.com; MPN: MF-LED-0805-RED; OC_NEWARK: unknown
OJ1-OJ4 OJ9-OJ20 = Seeed-Connector:DIP-BLACK-MALE-HEADER-VERT(2P-2.54): 320020016; MPN: P125-1102A0BS116A1
R1 R8 = resistor:R-US_: RESISTOR, American symbol
R2-R7 R9-R14 R17-R20 = SparkFun-Resistors:RESISTOR: Resistor Basic schematic elements and footprints for 0603, 1206, and PTH resistors.
REG = Seeed-IC-2016:PMIC-CJT1117-3.3(SOT223): 310030097; MPN: LDL1117S33R; VALUE: CJT1117-3.3-SOT223
RLEDPOW = resistor:R-EU_: RESISTOR, European symbol; MPN: MF-RES-0805-560; OC_NEWARK: unknown
VSLUE VSLUE2-VSLUE4 = SN74ACT244DW:SN74ACT244DW: SN74ACT244DW, 8-Bit Buffer, Line Driver, ACT, 3-State Non-Inverting 4.5 5.5 V 20-Pin SOIC Source: Datasheet <http://www.ti.com/lit/ds/symlink/sn74act244.pdf>; ARROW_PART_NUMBER: SN74ACT244DW; ARROW_PRICE-STOCK: https://www.arrow.com/en/products/sn74act244dw/texas-instruments; DESCRIPTION: SN74ACT244DW, 8-Bit Buffer, Line Driver, ACT, 3-State Non-Inverting 4.5 5.5 V 20-Pin SOIC; HEIGHT: 2.65mm; MANUFACTURER_NAME: Texas Instruments; MANUFACTURER_PART_NUMBER: SN74ACT244DW; RS_PART_NUMBER: 4363169; RS_PRICE-STOCK: http://uk.rs-online.com/web/p/products/4363169
X1 X2 X15 X16 = con-molex:87758-1616: 16 Pin - 2mm Dual Row Single Wafer, Vertical T/H HDR Source: http://www.molex.com/pdm_docs/sd/877580616_sd.pdf; MF: MOLEX; MPN: 87758-1616; OC_FARNELL: 7472366; OC_NEWARK: 59J1563
X13 X14 X17 X18 = con-molex:87758-2816: 28 Pin - 2mm Dual Row Single Wafer, Vertical T/H HDR Source: http://www.molex.com/pdm_docs/sd/877580616_sd.pdf; MF: MOLEX; MPN: 87758-2816; OC_FARNELL: unknown; OC_NEWARK: 25M5681

## Net classes
0 default: width 0.254 mm
1 power: width 0.305 mm